# EAGLE design ArduinoInterface_v2.1 (EAGLE 9.2.1)
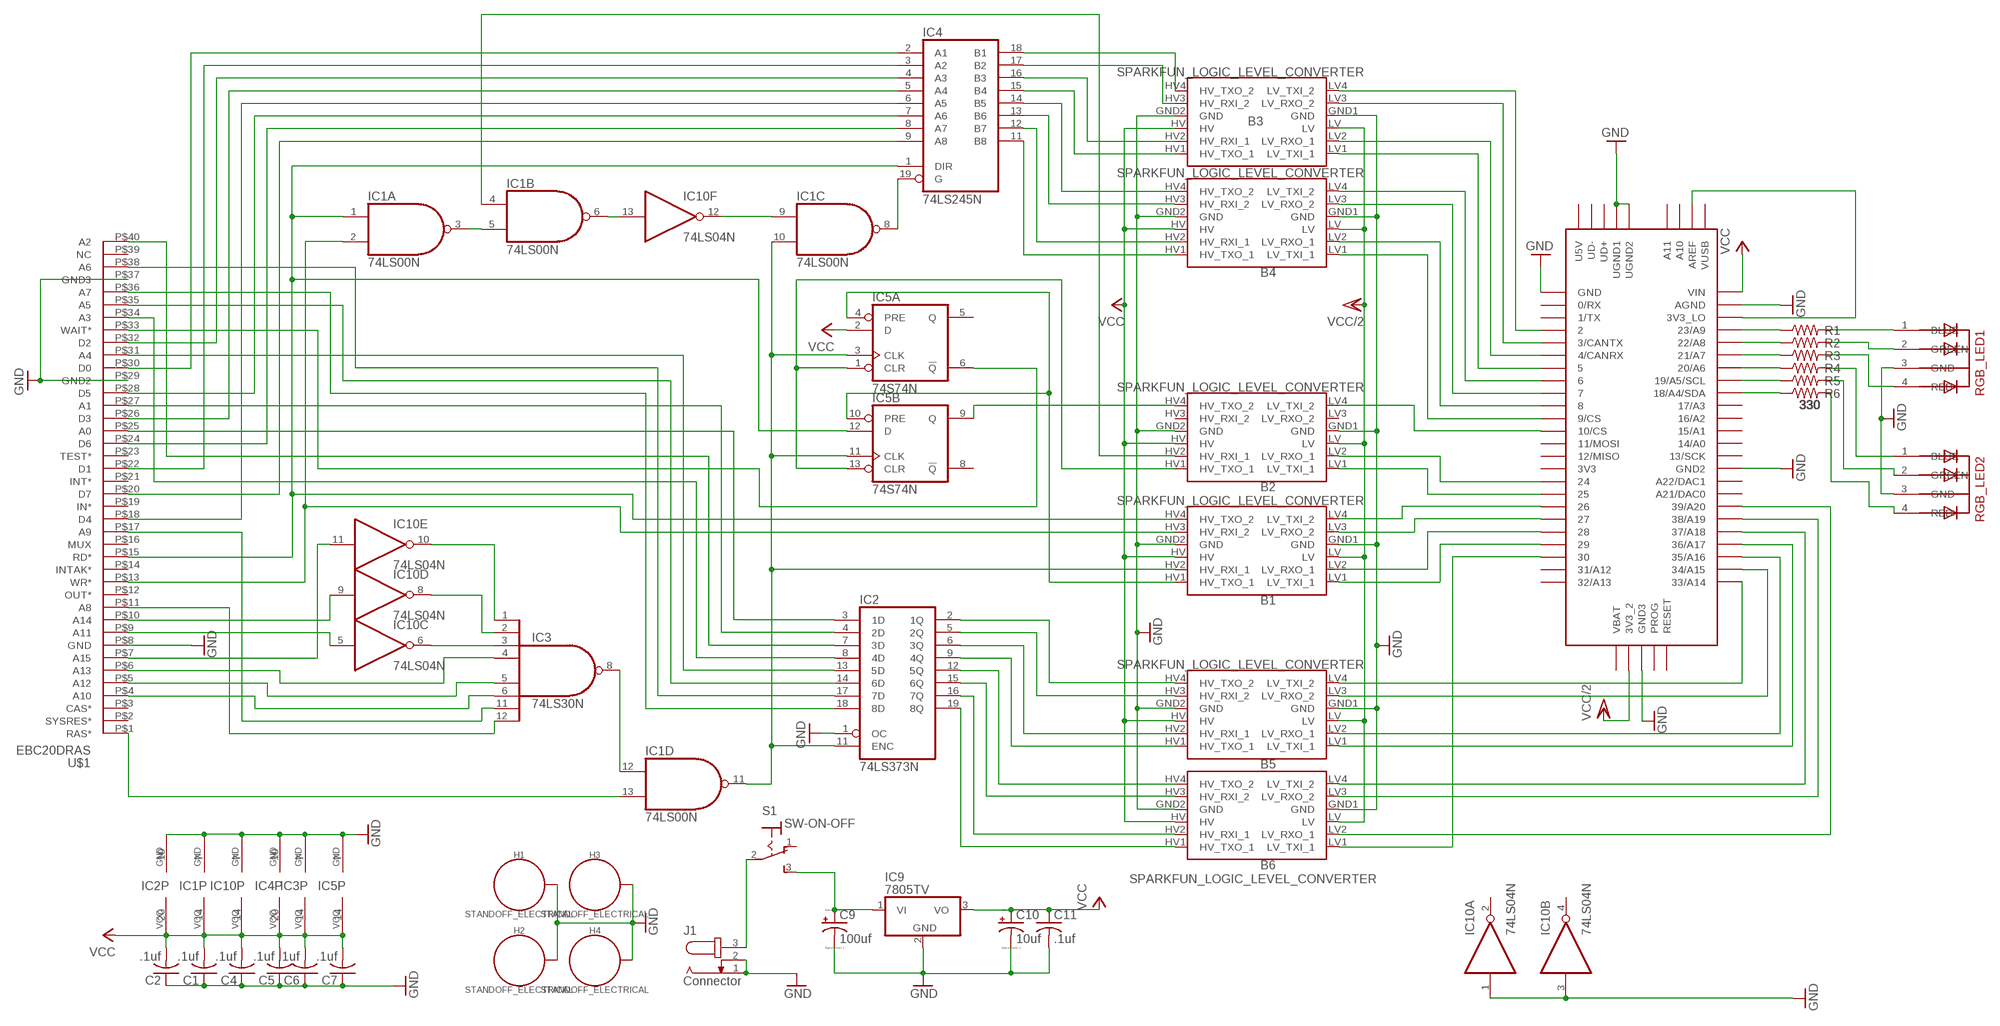
[diagram p0: schematic, sheet 1]

## Parts
B1  SPARKFUN_LOGIC_LEVEL_CONVERTER  [SPARKFUN_LOGIC_LEVEL_CONVERTER]
B2  SPARKFUN_LOGIC_LEVEL_CONVERTER  [SPARKFUN_LOGIC_LEVEL_CONVERTER]
B3  SPARKFUN_LOGIC_LEVEL_CONVERTER  [SPARKFUN_LOGIC_LEVEL_CONVERTER]
B4  SPARKFUN_LOGIC_LEVEL_CONVERTER  [SPARKFUN_LOGIC_LEVEL_CONVERTER]
B5  SPARKFUN_LOGIC_LEVEL_CONVERTER  [SPARKFUN_LOGIC_LEVEL_CONVERTER]
B6  SPARKFUN_LOGIC_LEVEL_CONVERTER  [SPARKFUN_LOGIC_LEVEL_CONVERTER]
C1  .1uf  C-US025-025X050  [C025-025X050]
C2  .1uf  C-US025-025X050  [C025-025X050]
C4  .1uf  C-US025-025X050  [C025-025X050]
C5  .1uf  C-US025-025X050  [C025-025X050]
C6  .1uf  C-US025-025X050  [C025-025X050]
C7  .1uf  C-US025-025X050  [C025-025X050]
C9  100uf  CPOL-USE5-6  [E5-6]
C10  10uf  CPOL-USE5-6  [E5-6]
C11  .1uf  C-US025-025X050  [C025-025X050]
H1  STANDOFF_ELECTRICAL  [STANDOFF-ELECTRICAL]
H2  STANDOFF_ELECTRICAL  [STANDOFF-ELECTRICAL]
H3  STANDOFF_ELECTRICAL  [STANDOFF-ELECTRICAL]
H4  STANDOFF_ELECTRICAL  [STANDOFF-ELECTRICAL]
IC1  74LS00N  [DIL14]
IC2  74LS373N  [DIL20]
IC3  74LS30N  [DIL14]
IC4  74LS245N  [DIL20]
IC5  74S74N  [DIL14]
IC9  7805TV  [TO220V]
IC10  74LS04N  [DIL14]
J1  Connector  JACK-PLUG0  [SPC4077]
R1  330  R-US_0204/2V  [0204V]
R2  330  R-US_0204/2V  [0204V]
R3  330  R-US_0204/2V  [0204V]
R4  330  R-US_0204/2V  [0204V]
R5  330  R-US_0204/2V  [0204V]
R6  330  R-US_0204/2V  [0204V]
RGB_LED1  5MMRGBLED  [LED5MMRGB]
RGB_LED2  5MMRGBLED  [LED5MMRGB]
S1  SW-ON-OFF  M9040P  [M9040P]
U$1  EBC20DRAS  [EBC20DRAS]
U$2  TEENSY_3.5/3.6  [TEENSY_3.5/3.6]

## Nets
A0: IC2.3(1D) U$1.P$25(A0)
A0_AFTER_LATCH: B5.HV4(HV_TXO_2) IC2.2(1Q)
A0_LV: B5.LV4(LV_TXI_2) U$2.33/A14
A1: IC2.4(2D) U$1.P$27(A1)
A1_AFTER_LATCH: B5.HV3(HV_RXI_2) IC2.5(2Q)
A1_LV: B5.LV3(LV_RXO_2) U$2.34/A15
A2: IC2.7(3D) U$1.P$40(A2)
A2_AFTER_LATCH: B5.HV2(HV_RXI_1) IC2.6(3Q)
A2_LV: B5.LV2(LV_RXO_1) U$2.35/A16
A3: IC2.8(4D) U$1.P$34(A3)
A3_AFTER_LATCH: B5.HV1(HV_TXO_1) IC2.9(4Q)
A3_LV: B5.LV1(LV_TXI_1) U$2.36/A17
A4: IC2.13(5D) U$1.P$31(A4)
A4_AFTER_LATCH: B6.HV4(HV_TXO_2) IC2.12(5Q)
A4_LV: B6.LV4(LV_TXI_2) U$2.37/A18
A5: IC2.14(6D) U$1.P$35(A5)
A5_AFTER_LATCH: B6.HV3(HV_RXI_2) IC2.15(6Q)
A5_LV: B6.LV3(LV_RXO_2) U$2.38/A19
A6: IC2.17(7D) U$1.P$38(A6)
A6_AFTER_LATCH: B6.HV2(HV_RXI_1) IC2.16(7Q)
A6_LV: B6.LV2(LV_RXO_1) U$2.39/A20
A7: IC2.18(8D) U$1.P$36(A7)
A7_AFTER_LATCH: B6.HV1(HV_TXO_1) IC2.19(8Q)
A7_LV: B6.LV1(LV_TXI_1) U$2.30
A8: IC3.12(I7) U$1.P$11(A8)
A9: IC3.11(I6) U$1.P$17(A9)
A10: IC3.6(I5) U$1.P$4(A10)
A11: IC10.5(C:I) U$1.P$9(A11)
A12: IC3.5(I4) U$1.P$5(A12)
A13: IC3.4(I3) U$1.P$6(A13)
A15: IC10.11(E:I) U$1.P$7(A15)
D0: IC4.2(A1) U$1.P$30(D0)
D0_LV: B3.LV4(LV_TXI_2) U$2.2
D1: IC4.3(A2) U$1.P$22(D1)
D1_LV: B3.LV3(LV_RXO_2) U$2.3/CANTX
D2: IC4.4(A3) U$1.P$32(D2)
D2_HV: B3.HV2(HV_RXI_1) IC4.16(B3)
D2_LV: B3.LV2(LV_RXO_1) U$2.4/CANRX
D3: IC4.5(A4) U$1.P$26(D3)
D3_HV: B3.HV1(HV_TXO_1) IC4.15(B4)
D3_LV: B3.LV1(LV_TXI_1) U$2.5
D4: IC4.6(A5) U$1.P$18(D4)
D4_HV: B4.HV4(HV_TXO_2) IC4.14(B5)
D4_LV: B4.LV4(LV_TXI_2) U$2.6
D5: IC4.7(A6) U$1.P$28(D5)
D5_HV: B4.HV3(HV_RXI_2) IC4.13(B6)
D5_LV: B4.LV3(LV_RXO_2) U$2.7
D6: IC4.8(A7) U$1.P$24(D6)
D6_HV: B4.HV2(HV_RXI_1) IC4.12(B7)
D6_LV: B4.LV2(LV_RXO_1) U$2.8
D7: IC4.9(A8) U$1.P$20(D7)
D7_HV: B4.HV1(HV_TXO_1) IC4.11(B8)
D7_LV: B4.LV1(LV_TXI_1) U$2.9/CS
DATA_BUS_ENABLE_: IC1.8(C:O) IC4.19(G)
DATA_BUS_ENABLE_HV_FROM_TEENSY: B2.HV2(HV_RXI_1) IC1.4(B:I0)
DATA_BUS_ENABLE_LV: B2.LV2(LV_RXO_1) U$2.24
FLIPFLOP_CLR: B2.HV1(HV_TXO_1) IC5.1(A:CLR) IC5.13(B:CLR)
FLIPFLOP_CLR_LV: B2.LV1(LV_TXI_1) U$2.25
FLIPFLOP_PRE: B1.HV1(HV_TXO_1) IC5.4(A:PRE) IC5.10(B:PRE)
FLIPFLOP_PRE_LV: B1.LV1(LV_TXI_1) U$2.29
GND: B1.GND1(GND) B1.GND2(GND) B2.GND1(GND) B2.GND2(GND) B3.GND1(GND) B3.GND2(GND) B4.GND1(GND) B4.GND2(GND) B5.GND1(GND) B5.GND2(GND) B6.GND1(GND) B6.GND2(GND) C1.1 C2.1 C4.1 C5.1 C6.1 C7.1 C9.- C10.- C11.2 H1.P1 H2.P1 H3.P1 H4.P1 IC1.7(P:GND) IC2.1(OC) IC2.10(GND) IC3.7(GND) IC4.10(GND) IC5.7(P:GND) IC9.2(GND) IC10.1(A:I) IC10.3(B:I) IC10.7(P:GND) J1.1 J1.2 RGB_LED1.3(GND) RGB_LED2.3(GND) U$1.P$8(GND) U$1.P$29(GND2) U$1.P$37(GND3) U$2.AGND U$2.GND U$2.GND2 U$2.GND3 U$2.UGND1 U$2.UGND2
INTERRUPT: B1.HV2(HV_RXI_1) IC1.10(C:I1) IC1.11(D:O) IC2.11(ENC) IC5.3(A:CLK) IC5.11(B:CLK)
INTERRUPT_LV: B1.LV2(LV_RXO_1) U$2.28
N$1: U$2.3V3_LO U$2.AREF
N$2: IC10.9(D:I) U$1.P$10(A14)
N$3: IC3.1(I0) IC10.10(E:O)
N$4: IC3.2(I1) IC10.8(D:O)
N$5: R1.1 U$2.23/A9
N$6: R2.1 U$2.22/A8
N$7: IC1.12(D:I0) IC3.8(O)
N$8: IC3.3(I2) IC10.6(C:O)
N$9: R3.1 U$2.21/A7
N$10: R1.2 RGB_LED1.1(BLUE)
N$12: C9.+ IC9.1(VI) S1.3(S)
N$13: B3.HV4(HV_TXO_2) IC4.18(B1)
N$14: R2.2 RGB_LED1.2(GREEN)
N$15: R3.2 RGB_LED1.4(RED)
N$16: R4.1 U$2.20/A6
N$17: R5.1 U$2.19/A5/SCL
N$18: R6.1 U$2.18/A4/SDA
N$19: R4.2 RGB_LED2.1(BLUE)
N$20: R5.2 RGB_LED2.2(GREEN)
N$21: R6.2 RGB_LED2.4(RED)
N$22: J1.3 S1.2(P)
N$24: B3.HV3(HV_RXI_2) IC4.17(B2)
N$26: IC1.13(D:I1) U$1.P$1(RAS*)
RD_: B1.HV4(HV_TXO_2) IC1.1(A:I0) IC4.1(DIR) IC5.12(B:D) U$1.P$15(RD*)
RD_LV_: B1.LV4(LV_TXI_2) U$2.26
RDX_OR_WRX_AND_DATA_BUS_ENABLE_FROM_TEENSY: IC1.9(C:I0) IC10.12(F:O)
RDX_OR_WRX_AND_DATA_BUS_ENABLE_FROM_TEENSY_: IC1.6(B:O) IC10.13(F:I)
READ_OR_WRITE: IC1.3(A:O) IC1.5(B:I1)
VCC: B1.HV B2.HV B3.HV B4.HV B5.HV B6.HV C1.2 C2.2 C4.2 C5.2 C6.2 C7.2 C10.+ C11.1 IC1.14(P:VCC) IC2.20(VCC) IC3.14(VCC) IC4.20(VCC) IC5.2(A:D) IC5.14(P:VCC) IC9.3(VO) IC10.14(P:VCC) U$2.VIN
VCC/2: B1.LV B2.LV B3.LV B4.LV B5.LV B6.LV U$2.3V3_2
WAIT_: IC5.6(A:!Q) U$1.P$33(WAIT*)
WR_: B1.HV3(HV_RXI_2) IC1.2(A:I1) U$1.P$13(WR*)
WR_HV: B2.HV4(HV_TXO_2) IC5.9(B:Q)
WR_LV: B2.LV4(LV_TXI_2) U$2.10/CS
WR_LV_: B1.LV3(LV_RXO_2) U$2.27
Unconnected: B2.HV3(HV_RXI_2) B2.LV3(LV_RXO_2) IC5.5(A:Q) IC5.8(B:!Q) IC10.2(A:O) IC10.4(B:O) S1.1(O) U$1.P$2(SYSRES*) U$1.P$3(CAS*) U$1.P$12(OUT*) U$1.P$14(INTAK*) U$1.P$16(MUX) U$1.P$19(IN*) U$1.P$21(INT*) U$1.P$23(TEST*) U$1.P$39(NC) U$2.0/RX U$2.1/TX U$2.3V3 U$2.11/MOSI U$2.12/MISO U$2.13/SCK U$2.14/A0 U$2.15/A1 U$2.16/A2 U$2.17/A3 U$2.21/DAC0(A21/DAC0) U$2.31/A12 U$2.32/A13 U$2.A10 U$2.A11 U$2.A22/DAC1 U$2.PROG U$2.RESET U$2.U5V U$2.UD+ U$2.UD- U$2.VBAT U$2.VUSB

## Library data of the parts
B1-B6 = SparkFun-Boards:SPARKFUN_LOGIC_LEVEL_CONVERTER: SparkFun Logic Level Converter -Bi-Directional This is the mechnical outline for the 3.3V - 5V bi directional logic level converter. *Note, the "LOCK" Package has the header pins staggered by an offset of 5 mils (off center line), so that when you slide a row of standard 0.1" headers into the PTH pads, it will hold position vertically. See the follwing turorial for more information on this type of special footprints: Sneaky Footprints <https://www.sparkfun.com/tutorials/114> SparkFun Products: SparkFun Logic Level Converter - Bi-Directional <https://www.sparkfun.com/products/12009>
C1 C2 C4-C7 C11 = adafruit:C-US: CAPACITOR, American symbol
C9 C10 = resistor:CPOL-US: POLARIZED CAPACITOR, American symbol
H1-H4 = SparkFun-Hardware:STANDOFF_ELECTRICAL: Stand Off Drill holes with an electrical connection. For example, use these to ground your board to a chassis. Example SparkFun Products Screw - Phillips Head (1/4", 4-40, 10 pack) <https://www.sparkfun.com/products/10453> (PRT-10453) Screw - Phillips Head (1/2", 4-40, 10 pack) <https://www.sparkfun.com/products/10452> (PRT-10452) Screw - Phillips Head (3/4", 4-40, 10 pack) <https://www.sparkfun.com/products/10451> (PRT-10451) Screw - Phillips Head (1", 4-40, 10 pack) <https://www.sparkfun.com/products/10450> (PRT-10450)
IC1 = 74xx-us:74*00: Quad 2-input NAND gate
IC2 = 74xx-us:74*373: Octal D type transparent LATCH, edge triggered
IC3 = 74xx-us:74*30: 8-input NAND gate
IC4 = 74xx-us:74*245: Octal BUS TRANSCEIVER, 3-state
IC5 = 74xx-us:74*74: Dual D type positive edge triggered FLIP FLOP, preset and clear
IC9 = linear:78*: Positive VOLTAGE REGULATOR Source: http://cache.national.com/ds/LM/LM78L05.pdf http://www.fairchildsemi.com/ds/LM/LM7805.pdf
IC10 = 74xx-us:74*04: Hex INVERTER
J1 = con-jack:JACK-PLUG: DC POWER JACK Power Jack, DC, Right Angle, Through Hole, Rated 5A at 16VDC, PC Terminals Distributor: Farnell (www.Farnell.de) Drawing: 84N1161.pdf / 84N1162.pdf Manufacturer: SPC Technology (www.spctechnology.com) Type: SPC4077 / SPC 4078; OC_FARNELL: unknown; OC_NEWARK: unknown
R1-R6 = resistor:R-US_: RESISTOR, American symbol
RGB_LED1 RGB_LED2 = adafruit:5MMRGBLED
S1 = switch:M9040P: TOGGLE SWITCH Marquardt
U$1 = TMS99:EBC20DRAS
U$2 = Teensy356:TEENSY_3.5/3.6

## Net classes
0 default: width 0.3 mm, clearance 0.05 mm

## Board
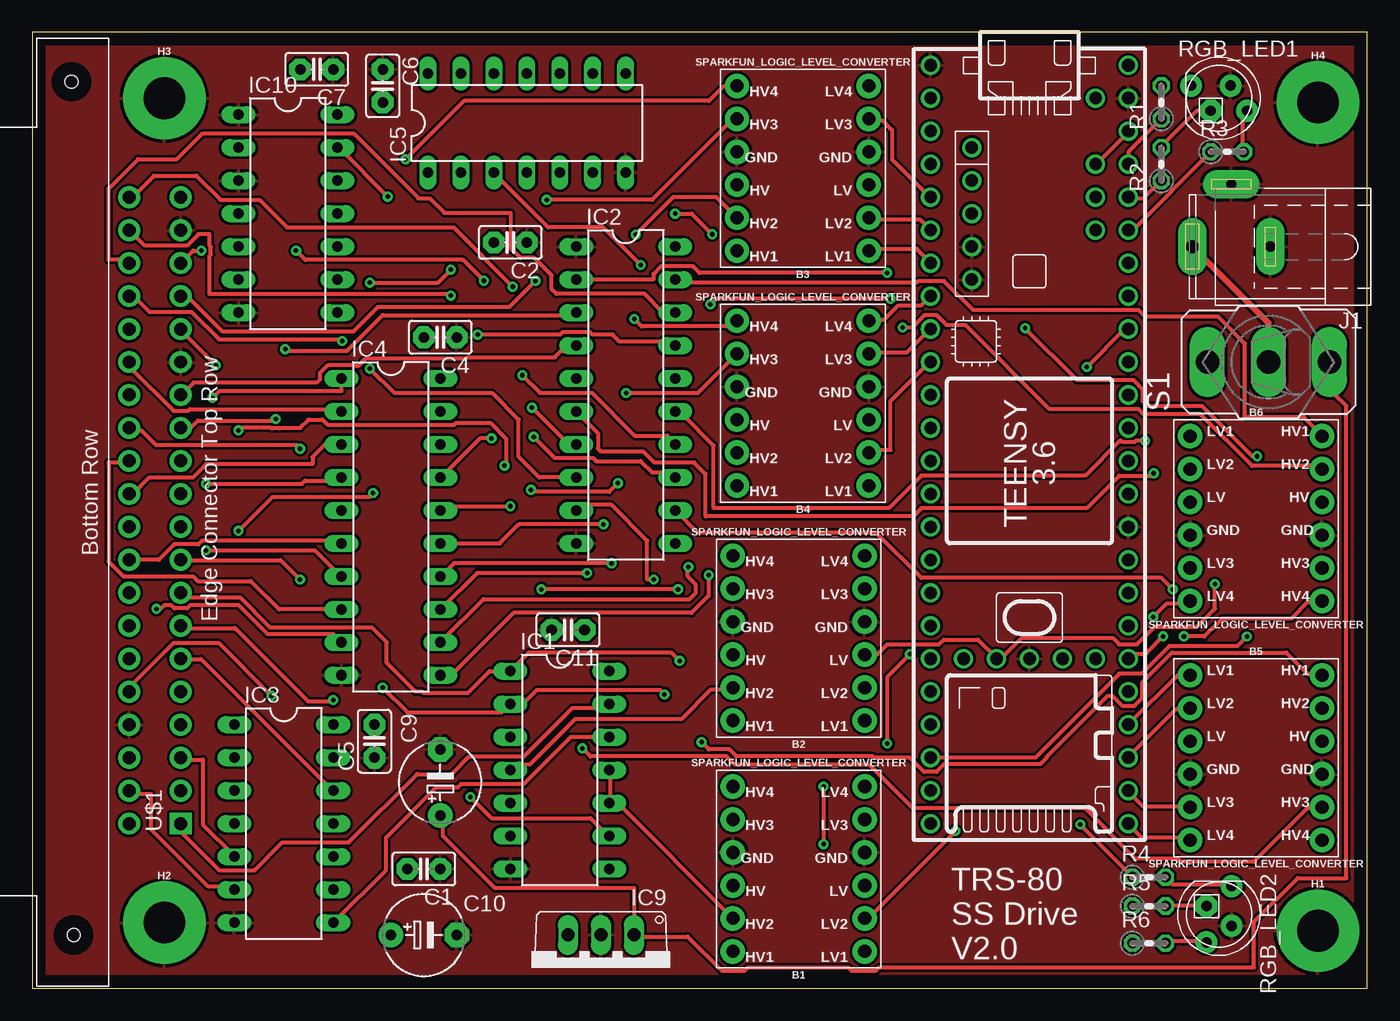
[diagram p1: board, top side]
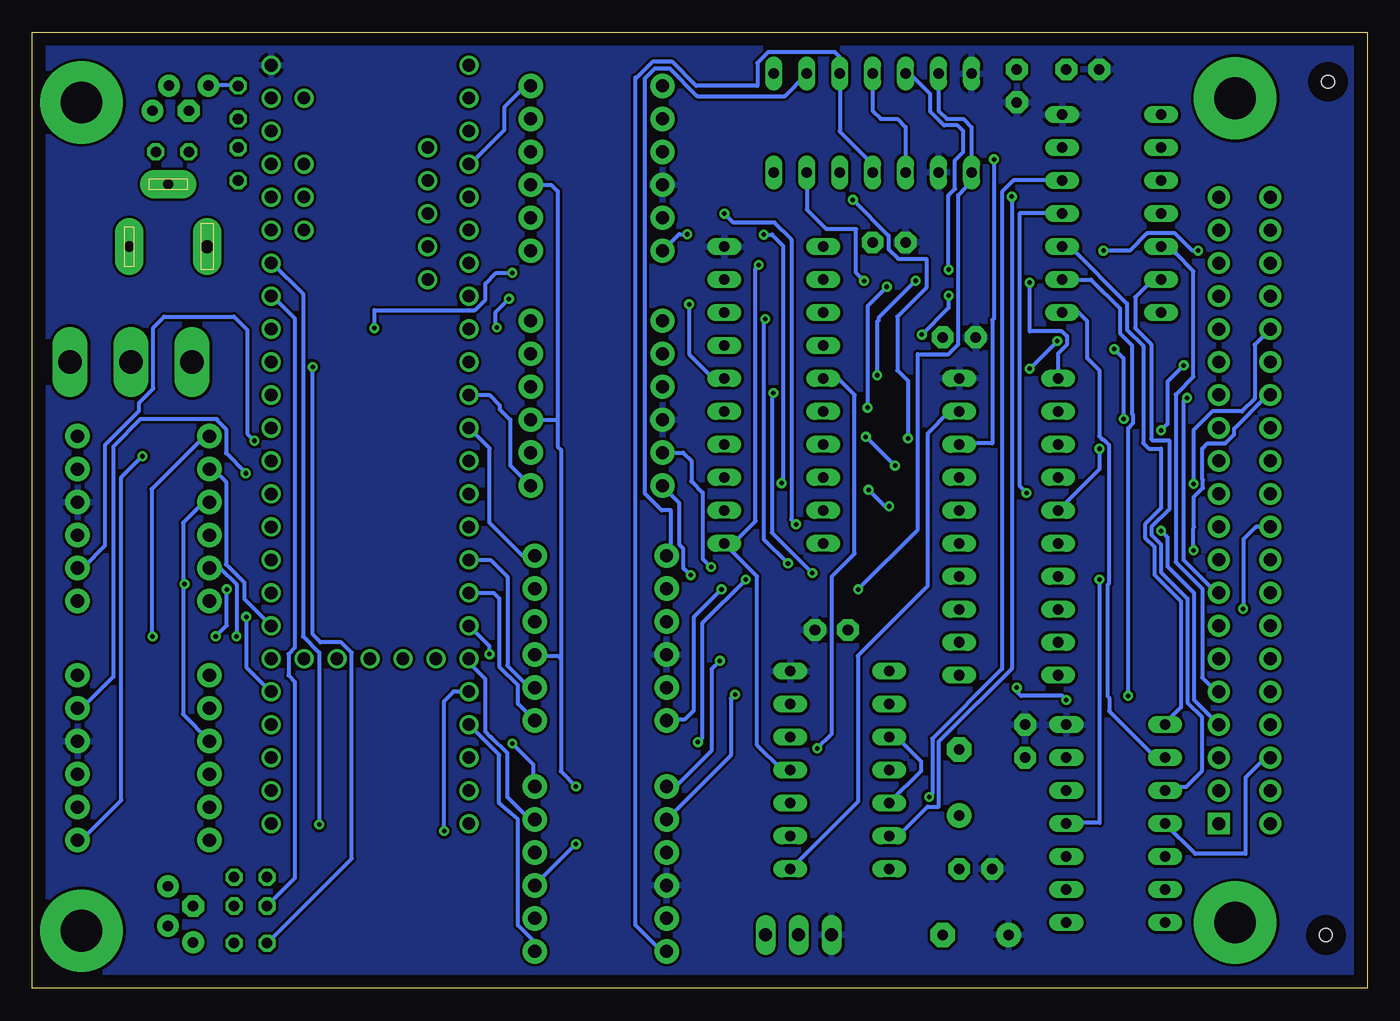
[diagram p2: board, bottom side, seen from below]

Size 102.85 x 73.65 mm. Coordinates in mm from the lower left corner, seen from the top.
Outline: 0,0 102.85,0 102.85,73.65 0,73.65 0,0
Copper layers (1*16): Top 0.035mm / dielectric 1.5mm / Bottom 0.035mm
Design rules "default": minimum track width 0.2mm, minimum drill 0.35mm, track to track 8mil, track to pad 8mil, pad to pad 8mil, via to via 8mil, smd to smd 8mil, copper to edge 40mil, drill to drill 6mil, minimum pad ring 10mil, minimum via ring 8mil, stop-mask expansion 4mil, vias tented up to drill 0mil, thermal gap 10mil

### Footprints (pad centres in the part's own frame; a part is rotated, then mirrored left to right if it is on the bottom)
SPARKFUN_LOGIC_LEVEL_CONVERTER = drill 1.016 pad 1.88: GND1 -5.08,-1.27; GND2 5.08,-1.27; HV 5.08,1.27; HV1 5.08,6.35; HV2 5.08,3.81; HV3 5.08,-3.81; HV4 5.08,-6.35; LV -5.08,1.27; LV1 -5.08,6.35; LV2 -5.08,3.81; LV3 -5.08,-3.81; LV4 -5.08,-6.35
C025-025X050 = drill 0.813 pad 1.676 octagon: 1 -1.27,0; 2 1.27,0
E5-6 = drill 0.813 pad 1.905: + -2.54,0 | drill 0.813 pad 1.905 octagon: - 2.54,0
STANDOFF-ELECTRICAL = drill 3.2 pad 6.35: P1 0,0
DIL14 = drill 0.813 long: 1 -7.62,-3.81; 2 -5.08,-3.81; 3 -2.54,-3.81; 4 0,-3.81; 5 2.54,-3.81; 6 5.08,-3.81; 7 7.62,-3.81; 8 7.62,3.81; 9 5.08,3.81; 10 2.54,3.81; 11 0,3.81; 12 -2.54,3.81; 13 -5.08,3.81; 14 -7.62,3.81
DIL20 = drill 0.813 long: 1 -11.43,-3.81; 2 -8.89,-3.81; 3 -6.35,-3.81; 4 -3.81,-3.81; 5 -1.27,-3.81; 6 1.27,-3.81; 7 3.81,-3.81; 8 6.35,-3.81; 9 8.89,-3.81; 10 11.43,-3.81; 11 11.43,3.81; 12 8.89,3.81; 13 6.35,3.81; 14 3.81,3.81; 15 1.27,3.81; 16 -1.27,3.81; 17 -3.81,3.81; 18 -6.35,3.81; 19 -8.89,3.81; 20 -11.43,3.81
TO220V = drill 1.016 long: 1 -2.54,-2.54; 2 0,-2.54; 3 2.54,-2.54
SPC4077 = drill 0.8 pad 2.184 long: 1 -3,0; 2 0,-4.8 | drill 1 pad 2.184 long: 3 3,0
0204V = drill 0.813 octagon: 1 -1.27,0; 2 1.27,0
LED5MMRGB = drill 0.8 pad 1.676: 1 -2.159,0.968; 3 0.889,0.968; 4 2.159,-0.968 | drill 0.8 pad 1.676 octagon: 2 -0.635,-0.968
M9040P = drill 1.803 long: 1 0,4.699; 2 0,0; 3 0,-4.699
EBC20DRAS = drill 1 pad 1.676 square: P$1 0,0 | drill 1 pad 1.676: P$2 0,3.969; P$3 2.54,0; P$4 2.54,3.969; P$5 5.08,0; P$6 5.08,3.969; P$7 7.62,0; P$8 7.62,3.969; P$9 10.16,0; P$10 10.16,3.969; P$11 12.7,0; P$12 12.7,3.969; P$13 15.24,0; P$14 15.24,3.969; P$15 17.78,0; P$16 17.78,3.969; P$17 20.32,0; P$18 20.32,3.969; P$19 22.86,0; P$20 22.86,3.969; P$21 25.4,0; P$22 25.4,3.969; P$23 27.94,0; P$24 27.94,3.969; P$25 30.48,0; P$26 30.48,3.969; P$27 33.02,0; P$28 33.02,3.969; P$29 35.56,0; P$30 35.56,3.969; P$31 38.1,0; P$32 38.1,3.969; P$33 40.64,0; P$34 40.64,3.969; P$35 43.18,0; P$36 43.18,3.969; P$37 45.72,0; P$38 45.72,3.969; P$39 48.26,0; P$40 48.26,3.969 | hole 1: -8.572,8.255; 57.15,8.414
TEENSY_3.5/3.6 = drill 0.965: 0/RX -25.4,-7.62; 1/TX -22.86,-7.62; 2 -20.32,-7.62; 3/CANTX -17.78,-7.62; 3V3 7.62,-7.62; 3V3_2 17.78,-2.54; 3V3_LO -22.86,7.62; 4/CANRX -15.24,-7.62; 5 -12.7,-7.62; 6 -10.16,-7.62; 7 -7.62,-7.62; 8 -5.08,-7.62; 9/CS -2.54,-7.62; 10/CS 0,-7.62; 11/MOSI 2.54,-7.62; 12/MISO 5.08,-7.62; 13/SCK 5.08,7.62; 14/A0 2.54,7.62; 15/A1 0,7.62; 16/A2 -2.54,7.62; 17/A3 -5.08,7.62; 18/A4/SDA -7.62,7.62; 19/A5/SCL -10.16,7.62; 20/A6 -12.7,7.62; 21/A7 -15.24,7.62; 21/DAC0 12.7,7.62; 22/A8 -17.78,7.62; 23/A9 -20.32,7.62; 24 10.16,-7.62; 25 12.7,-7.62; 26 15.24,-7.62; 27 17.78,-7.62; 28 20.32,-7.62; 29 22.86,-7.62; 30 25.4,-7.62; 31/A12 27.94,-7.62; 32/A13 30.48,-7.62; 33/A14 30.48,7.62; 34/A15 27.94,7.62; 35/A16 25.4,7.62; 36/A17 22.86,7.62; 37/A18 20.32,7.62; 38/A19 17.78,7.62; 39/A20 15.24,7.62; A10 -17.78,5.08; A11 -15.24,5.08; A22/DAC1 10.16,7.62; AGND -25.4,7.62; AREF -20.32,5.08; GND -27.94,-7.62; GND2 7.62,7.62; GND3 17.78,0; PROG 17.78,2.54; RESET 17.78,5.08; U5V -21.59,-4.445; UD+ -16.51,-4.445; UD- -19.05,-4.445; UGND1 -13.97,-4.445; UGND2 -11.43,-4.445; VBAT 17.78,-5.08; VIN -27.94,7.62; VUSB -25.4,5.08

### Placement (x,y rotation side)
B1  59.05,9.21 180 top
B2  59.05,26.99 180 top
B3  59.37,63.18 180 top
B4  59.37,45.09 180 top
B5  94.3,17.78 0 top
B6  94.3,36.2 0 top
C1  30.16,9.21 180 top
C2  36.83,57.47 180 top
C4  31.43,50.16 180 top
C5  26.35,19.05 90 top
C6  26.99,69.53 270 top
C7  21.91,70.8 180 top
C9  31.43,15.88 90 top
C10  30.16,4.13 0 top
C11  41.27,27.62 180 top
H1  99.06,4.45 0 top
H2  10.16,5.08 0 top
H3  10.16,68.58 0 top
H4  99.06,68.26 0 top
IC1  40.64,16.83 270 top
IC2  45.72,45.72 270 top
IC3  19.37,12.7 270 top
IC4  27.62,35.56 270 top
IC5  38.1,66.67 0 top
IC9  43.81,1.59 180 top
IC10  19.68,59.69 270 top
J1  92.39,57.15 180 top
R1  87,68.26 90 top
R2  87,63.5 90 top
R3  92.08,64.45 0 top
R4  86.04,8.57 0 top
R5  86.04,6.35 0 top
R6  86.04,3.49 0 top
RGB_LED1  91.44,68.58 0 top
RGB_LED2  91.44,5.71 270 top
S1  95.25,48.26 90 top
U$1  11.43,12.7 90 top
U$2  76.83,43.18 270 top

### Tracks (layer width: path | path; a pad name or v marks a point on that pad's centre or on a via)
A0  (via drill 0.35)
  Top 0.3: v19.48,49.25 19.48,49.12 24.25,49.12 27,51.88 41.75,51.88 41.88,52 IC2.3 | v18.75,43.88 18.62,43.75 12.75,43.75 12.25,43.25 11.5,43.25 U$1.P$25
  Bottom 0.3: v19.48,49.25 18.75,48.52 v18.75,43.88
A0_AFTER_LATCH  (via drill 0.35)
  Top 0.3: v65.88,55.12 51.4,55.12 50.9,55.62 48.45,55.62 47.86,55.03 47.86,54.61 IC2.2 | v76.5,50.87 80.49,46.88 84.84,46.88 85.55,46.17 85.55,45.27 85.94,44.88 90.12,44.88 94,41 v94.38,41
  Bottom 0.3: v76.5,50.87 76.5,52.25 68.75,52.25 67.94,53.05 67.94,54.29 67.11,55.12 v65.88,55.12 | v94.38,41 96,39.38 96,14.5 99,11.5 99.38,11.5 B5.HV4
A0_LV
  Top 0.3: U$2.33/A14 84.5,12.62 85.5,11.62 89,11.62 89.12,11.5 B5.LV4
A1
  Top 0.3: IC2.4 41.88,49.5 41.5,49.12 40.75,49.12 40.25,48.62 33.5,48.62 33.38,48.5 25.64,48.5 25.08,47.94 24.95,47.94 24.89,48 22.73,48 22.14,47.41 22.14,46.9 21.91,46.67 12.42,46.67 11.5,45.75 U$1.P$27
A1_AFTER_LATCH  (via drill 0.35)
  Top 0.3: v42.38,18.5 43,17.88 53.5,17.88 54.12,17.25 64.49,17.25 67.86,13.88 81.12,13.88 85,10 88.25,10 88.5,9.75 94.12,9.75 98.25,13.88 99.38,13.88 B5.HV3
  Bottom 0.3: v42.38,18.5 41.25,19.62 41.25,31.75 39.5,33.5 39.5,45.72 40.77,46.99 IC2.5
A1_LV
  Top 0.3: U$2.34/A15 84.5,15.12 85.62,14 89.12,14 B5.LV3
A2  (via drill 0.35)
  Top 0.3: IC2.7 41.33,41.91 v38.5,44.74 | v37.01,54.06 32.44,58.62 19.62,58.62 17.5,60.75 14.5,60.75 12.62,62.62 9.38,62.62 7.75,61 7.5,61 U$1.P$40
  Bottom 0.3: v38.5,44.74 38.5,52.57 v37.01,54.06
A2_AFTER_LATCH  (via drill 0.35)
  Top 0.3: 42,44.38 IC2.6 43.58,42.78 43.58,41.59 43.8,41.38 47.05,41.38 47.93,40.5 51,40.5 51.88,39.62 51.88,36.38 67.88,36.38 68.5,37 81.25,37 83.75,39.5 86.22,39.5 v86.41,39.69
  Bottom 0.3: B5.HV2 99.38,21.62 99,21.62 96.62,24 96.62,41.75 94.5,43.88 88.62,43.88 88.62,43.78 87.92,43.08 87.92,41.25 86.41,39.74 v86.41,39.69
A2_LV
  Top 0.3: U$2.35/A16 84.5,17.88 88.12,21.5 89.12,21.5 B5.LV2
A3  (via drill 0.35)
  Top 0.3: v26,47.75 27.88,45.88 35.41,45.88 37.47,43.81 37.47,40.96 39.05,39.37 IC2.8 | v23.88,49.88 23.75,50 14.38,50 12.25,52.12 9,52.12 7.88,53.25 7.5,53.25 U$1.P$34
  Bottom 0.3: v23.88,49.88 v26,47.75
A3_AFTER_LATCH  (via drill 0.35)
  Top 0.3: v47.88,31.5 47.38,31.5 47.38,34.5 44.62,37.25 42.38,37.25 42,36.88 IC2.9 | B5.HV1 99.38,24.25 98.25,24.25 96.63,25.87 87.81,25.87 85.55,23.6 85.55,22.41 84.91,21.77 84,21.77 83.23,22.54 82.87,22.54 78.16,17.84 78.16,17.76 77.68,17.28 70.25,17.28 69.67,16.69 68.72,16.69 67.63,17.78 64.87,17.78 64.78,17.88 54.25,17.88 53.71,18.41 52.12,18.41 v51.57,18.97
  Bottom 0.3: v47.88,31.5 51.25,28.12 51.25,19.29 v51.57,18.97
A3_LV
  Top 0.3: U$2.36/A17 84.5,20.38 88.25,24.12 89.12,24.12 B5.LV1
A4  (via drill 0.35)
  Top 0.3: v38.62,42.5 40.25,40.88 43.19,40.88 43.44,40.62 46.88,40.62 47.75,39.75 49.12,39.75 49.5,39.38 IC2.13 | v14.12,48 11.38,50.75 U$1.P$31 | v36.38,40.28 36.51,40.41 36.51,42.34 35.29,43.56 32.64,43.56 32.51,43.44 22.73,43.44 22.35,43.81 21.27,43.81 20.64,43.18 19.09,43.18 19.05,43.14 18.45,43.14 18.41,43.18 16.05,43.18 v15.88,43
  Bottom 0.3: v38.62,42.5 36.4,40.28 v36.38,40.28 | v15.88,43 15.38,43.5 15.38,46.75 v14.12,48
A4_AFTER_LATCH  (via drill 0.35)
  Top 0.3: v87.88,30.75 87,31.62 68.5,31.62 65,35.12 51.25,35.12 49.62,36.75 IC2.12 | v88.73,27.12 90.32,27.12 91.69,28.5 97,28.5 98.25,29.75 99.38,29.75 B6.HV4
  Bottom 0.3: v87.88,30.75 87.88,27.98 v88.73,27.12
A4_LV  (via drill 0.35)
  Top 0.3: v86.38,28.62 87.38,29.62 89,29.62 89.12,29.75 B6.LV4
  Bottom 0.3: v86.38,28.62 86.38,24.75 84.5,22.88 U$2.37/A18
A5  (via drill 0.35)
  Top 0.3: v37.75,47.24 39.12,45.88 43.12,45.88 46.41,42.59 48.91,42.59 49.5,42 IC2.14 | v34.79,54.52 33.17,56.14 21.02,56.14 v20.32,56.83 | U$1.P$35 12.38,56.83 v13.02,56.83
  Bottom 0.3: v37.75,47.24 37.75,51.37 37.65,51.47 37.65,51.66 v34.79,54.52 | v13.02,56.83 13.46,56.83 14.79,58.16 16.95,58.16 18.29,56.83 v20.32,56.83
A5_AFTER_LATCH  (via drill 0.35)
  Top 0.3: v85.75,42.19 85.01,42.19 84.91,42.09 84,42.09 83.9,42.19 83.82,42.19 81.12,39.5 68.5,39.5 66,37 52.5,37 52.5,41.82 50.16,44.15 50.16,44.45 IC2.15
  Bottom 0.3: B6.HV3 99.38,32.5 98.88,32.5 97.25,34.12 97.25,41.88 94.62,44.5 94.62,45.12 93.54,46.2 93.54,50.92 92.71,51.75 87.31,51.75 86.3,50.74 86.3,42.74 v85.75,42.19
A5_LV  (via drill 0.35)
  Top 0.3: v87.12,27.12 85.75,25.75 84.75,25.75 84.5,25.5 U$2.38/A19
  Bottom 0.3: v87.12,27.12 87.12,31.12 88.38,32.38 89.12,32.38 B6.LV3
A6  (via drill 0.35)
  Top 0.3: v32.25,53.38 32.12,53.5 13.65,53.5 13.65,56.43 13.75,56.53 13.75,57.13 13.65,57.23 13.65,58.1 12.8,58.1 11.92,57.23 8.65,57.23 U$1.P$38 | IC2.17 49.5,49.62 49.25,49.88 45.2,49.88 44.71,50.37 43.17,50.37 42.99,50.54 40.83,50.54 40.65,50.37 v34.31,50.37
  Bottom 0.3: v34.31,50.37 32.25,52.42 v32.25,53.38
A6_AFTER_LATCH  (via drill 0.35)
  Top 0.3: v52.25,52.7 52.67,53.12 v66.12,53.12 | B6.HV2 99.38,40.12 99.25,40.25 94,40.25 90,44.25 85.62,44.25 85.25,44.62 78.38,44.62 71.88,51.12 70.44,51.12 69.67,51.89 68.76,51.89 67.8,50.92 v67.06,50.92
  Bottom 0.3: v52.25,52.7 52.25,48.88 50.62,47.25 50.62,47 49.62,47 IC2.16 | v66.12,53.12 67.18,52.07 67.18,51.05 v67.06,50.92
A6_LV
  Bottom 0.3: U$2.39/A20 84.5,28 86.5,30 86.5,31.25 87.92,32.68 87.92,39.02 88.91,40.01 B6.LV2
A7
  Top 0.3: IC2.18 48.6,52.07 47.17,53.5 40.38,53.5 40.01,53.87 40.01,54.93 38.66,56.28 37.61,56.28 36.88,57 36.88,59.75 31.75,59.75 30.62,60.88 29.75,60.88 24.75,65.88 13.12,65.88 11.13,63.88 8.13,63.88 5.88,61.62 5.88,56.12 7.25,56.12 7.38,56 U$1.P$36
A7_AFTER_LATCH
  Top 0.3: IC2.19 49.62,54.5 49.75,54.38 68.12,54.38 68.25,54.5 70.25,54.5 72.5,52.25 85.25,52.25 85.75,51.75 91.38,51.75 93.44,49.68 93.44,44.02 97.98,44.02 99.38,42.62 B6.HV1
A7_LV  (via drill 0.35)
  Top 0.3: v93.59,27.11 92.85,26.38 87.61,26.38 85.48,24.25 83.75,24.25 77.28,17.78 U$2.30
  Bottom 0.3: B6.LV1 89.25,42.5 89.62,42.5 93.66,38.46 93.66,27.19 v93.59,27.11
A8
  Top 0.3: IC3.12 23.12,15.25 13,25.38 11.5,25.38 U$1.P$11
A9  (via drill 0.35)
  Top 0.3: v20.62,31.5 19.12,33 11.5,33 U$1.P$17
  Bottom 0.3: v20.62,31.5 20.62,12.75 23.12,12.75 IC3.11
A10
  Top 0.3: IC3.6 15.5,7.62 15.25,7.88 13.5,7.88 9.12,12.25 9.12,15 8.25,15 8.12,15.12 7.5,15.12 U$1.P$4
A11
  Bottom 0.3: IC10.5 15.88,57.12 14.75,57.12 14.75,56.62 13.38,55.25 13.38,47.12 14.75,45.75 14.75,32.85 12.7,30.8 12.7,23.95 11.5,22.75 U$1.P$9
A12
  Top 0.3: IC3.5 15.5,10.25 13.12,12.62 13.12,17.62 11.62,17.62 11.5,17.75 U$1.P$5
A13
  Bottom 0.3: IC3.4 15.5,12.62 13.25,10.38 9.38,10.38 9.38,16.25 7.88,17.75 7.5,17.75 U$1.P$6
A15  (via drill 0.35)
  Top 0.3: v26.25,38.17 25.95,37.88 18.5,37.88 v15.88,35.25
  Bottom 0.3: v26.25,38.17 26.75,38.67 26.75,59.75 23.5,59.75 IC10.11 | v15.88,35.25 15.38,34.75 15.38,32.52 13.34,30.48 13.34,22.23 11.5,20.39 11.5,20.38 U$1.P$7
D0
  Top 0.3: IC4.2 23.75,44.5 23.62,44.62 12.12,44.62 12,44.5 10.88,44.5 7.5,47.88 7.5,48.25 U$1.P$30
D0_LV
  Bottom 0.3: U$2.2 69.12,63.5 66.5,66.12 66.5,67.88 64.88,69.5 64.5,69.5 B3.LV4
D1
  Top 0.3: U$1.P$22 7.5,38.12 7.75,38.12 9,39.38 12.38,39.38 13.38,40.38 21.59,40.38 21.59,40.96 22.54,41.91 IC4.3
D1_LV
  Top 0.3: U$2.3/CANTX 69.12,61 66.25,63.88 66.25,66.12 65.5,66.88 64.5,66.88 B3.LV3
D2  (via drill 0.35)
  Top 0.3: v13.38,38.88 20.75,38.88 21,39.12 23.62,39.12 23.75,39.25 IC4.4
  Bottom 0.3: v13.38,38.88 13.38,43 11.93,44.45 9.64,44.45 8.65,45.43 8.65,49.61 U$1.P$32
D2_HV  (via drill 0.35)
  Top 0.3: v45.12,38.92 44.45,38.25 38.59,38.25 v38.42,38.42 | 31.5,36.88 IC4.16 32.07,36.83 32.38,37.15 v36.83,37.15 | B3.HV2 52.7,60.96 49.38,60.96 v46.49,58.07
  Bottom 0.3: v45.12,38.92 45,39.05 45,57.21 45.85,58.07 v46.49,58.07 | v38.42,38.42 37.15,37.15 v36.83,37.15
D2_LV
  Top 0.3: U$2.4/CANRX 69.12,58.5 68.38,59.25 64.5,59.25 B3.LV2
D3  (via drill 0.35)
  Top 0.3: v20.62,41.58 20.33,41.88 9.5,41.88 8.38,43 7.62,43 7.5,43.12 U$1.P$26
  Bottom 0.3: v20.62,41.58 20.62,40 23.75,36.88 IC4.5
D3_HV  (via drill 0.35)
  Top 0.3: v44,35.75 37.47,35.75 36.01,34.29 IC4.15 | v49.53,59.69 50.8,59.69 v52.39,58.1
  Bottom 0.3: v44,35.75 44.38,36.12 44.38,57.71 45.66,59 48.84,59 v49.53,59.69 | 53.88,56.88 54.25,56.88 B3.HV1 53.02,58.1 v52.39,58.1
D3_LV
  Top 0.3: U$2.5 69.12,56 68.12,57 64.62,57 64.5,56.88 B3.LV1
D4
  Top 0.3: IC4.6 23.75,34.38 23.62,34.5 13.08,34.5 12.79,34.21 10.94,34.21 9.74,33.02 U$1.P$18
D4_HV  (via drill 0.35)
  Top 0.3: v44.62,32.75 32.5,32.75 31.5,31.75 IC4.14 | v46.38,51.58 46.95,51 53.88,51 54.25,51.38 B4.HV4
  Bottom 0.3: v44.62,32.75 46.5,34.62 46.5,51.58 v46.38,51.58
D4_LV
  Top 0.3: U$2.6 68.5,52.62 66.75,52.62 65.62,51.5 64.5,51.5 B4.LV4
D5  (via drill 0.35)
  Top 0.3: v13.38,33.75 21.75,33.75 23.75,31.75 IC4.7
  Bottom 0.3: v13.38,33.75 13.38,35.5 13.34,35.54 13.34,37.88 12.64,38.57 12.64,39.18 12.7,39.23 12.7,41.59 12.3,41.99 10.94,41.99 10.24,42.69 10.24,43.14 7.75,45.62 7.5,45.62 U$1.P$28
D5_HV  (via drill 0.35)
  Top 0.3: v42.75,32 34.25,32 31.5,29.25 IC4.13 | v45.75,45.88 51.27,45.88 B4.HV3
  Bottom 0.3: v42.75,32 45.88,35.12 45.88,45.75 v45.75,45.88
D5_LV
  Top 0.3: U$2.7 69.12,50.75 67.38,49 64.5,49 B4.LV3
D6
  Top 0.3: 23.75,29.25 IC4.8 19,29.21 16.83,31.39 12.74,31.39 12.38,31.75 7,31.75 5.88,32.88 5.88,40.5 7.25,40.5 7.38,40.62 U$1.P$24
D6_HV  (via drill 0.35)
  Top 0.3: IC4.12 31.5,26.75 34.75,30 50.64,30 51.12,30.48 51.12,31.11 50.48,31.75 50.48,32.4 v50.55,32.46
  Bottom 0.3: 54.25,41.25 B4.HV2 52.7,41.27 52.07,40.64 52.07,39.07 51.2,38.2 51.2,33.12 v50.55,32.46
D6_LV
  Top 0.3: U$2.8 69.12,48.25 66.12,45.25 66.12,41.5 64.62,41.5 64.5,41.38 B4.LV2
D7  (via drill 0.35)
  Top 0.3: IC4.9 23.18,27.3 18.11,27.3 15.88,29.53 12.17,29.53 11.92,29.29 10.94,29.29 10.69,29.53 10.16,29.53 9.88,29.25 v9.56,29.25
  Bottom 0.3: 9.69,29.39 v9.56,29.25 9.53,29.28 9.53,34.61 8.57,35.56 U$1.P$20
D7_HV  (via drill 0.35)
  Top 0.3: IC4.11 32.26,24.13 37.06,28.93 50.81,28.93 52.12,30.24 v52.12,31.84
  Bottom 0.3: B4.HV1 54.26,38.64 53,37.38 53,34.19 52.68,33.87 52.68,32.36 52.16,31.84 v52.12,31.84
D7_LV
  Bottom 0.3: U$2.9/CS 67.63,45.72 66.84,44.92 | 66.84,44.92 66.82,44.91 | B4.LV1 64.5,38.75 66.04,40.29 66.04,43.81 66.84,44.61 66.84,44.92
DATA_BUS_ENABLE_
  Bottom 0.3: IC1.8 44.38,9.25 39.25,14.38 39.25,25.62 33.88,31 33.88,42.75 32.25,44.38 31.5,44.38 IC4.19
DATA_BUS_ENABLE_HV_FROM_TEENSY
  Top 0.3: IC1.4 36.88,16.88 37.25,17.25 38.32,17.25 41.82,20.75 50,20.75 52.25,23 53.75,23 53.88,23.12 B2.HV2
DATA_BUS_ENABLE_LV
  Bottom 0.3: B2.LV2 64.25,23.25 64.62,23.25 66.25,24.88 66.25,31.71 67.56,33.02 U$2.24
FLIPFLOP_CLR  (via drill 0.35)
  Top 0.3: v49.75,30.75 v39.22,30.75
  Bottom 0.3: v39.22,30.75 34.62,35.34 34.62,48.88 32.25,48.88 31.5,49.62 31.5,61.12 30.88,61.75 30.88,62.38 30.5,62.75 IC5.1 30.48,66.36 31.11,66.99 32.38,66.99 33.02,67.63 IC5.13 | v49.75,30.75 51.88,28.62 51.88,21.42 52.55,20.75 53.88,20.75 B2.HV1
FLIPFLOP_CLR_LV
  Bottom 0.3: B2.LV1 65.43,21.93 65.43,23.34 66.88,24.79 66.88,30.05 67.31,30.48 U$2.25
FLIPFLOP_PRE
  Bottom 0.3: IC5.4 38.12,62.88 38.5,63.25 38.5,63.88 40.65,66.03 40.64,66.04 IC5.10 40.64,71.75 41.04,72.16 46.14,72.16 46.99,71.31 46.99,69.53 51.7,69.53 53.54,71.38 55.08,71.38 56.29,70.17 56.38,70.17 56.38,4.88 54.38,2.88 54,2.88 B1.HV1
FLIPFLOP_PRE_LV
  Bottom 0.3: U$2.29 69.12,20.25 66.88,18 66.88,14.29 65.43,13.02 65.43,4.86 64.14,3.57 B1.LV1 64.25,2.88
GND
  pour Top: 0,73.66 0.32,-0.32 103.19,0.32 103.19,73.03
INTERRUPT  (via drill 0.35)
  Top 0.3: IC1.11 44.5,16.75 44.5,14.38 IC1.10 44.62,14.38 45,14.38 53.88,5.5 B1.HV2 | v46.88,55.74 43.99,58.62 39.75,58.62 35.62,62.75 IC5.3
  Bottom 0.3: IC1.11 44.5,16.88 45.12,16.88 47,18.75 47,31.75 49.5,34.25 IC2.11 49.12,34 47.12,36 47.12,55.49 v46.88,55.74 | IC5.11 38.1,67.63 37.47,66.99 36.2,66.99 35.56,66.36 IC5.3
INTERRUPT_LV  (via drill 0.35)
  Top 0.3: v71.12,12.12 64.5,5.5 64.25,5.5 B1.LV2
  Bottom 0.3: U$2.28 70.41,22.86 71.12,22.14 v71.12,12.12
N$1
  Top 0.3: U$2.AREF 82,63.5 84.5,66 U$2.3V3_LO
N$2  (via drill 0.35)
  Top 0.3: U$1.P$10 7.5,22.88 7.5,23.25 10.88,26.62 14.33,26.62 v18.41,22.54
  Bottom 0.3: v18.41,22.54 18.41,43.18 18.02,43.57 18.02,44.18 18.1,44.26 18.1,49.53 19.05,50.48 19.05,52.39 21.27,54.61 IC10.9
N$3
  Bottom 0.3: IC3.1 15.62,20.38 14.34,21.66 14.34,29.82 16.38,31.86 16.38,34.01 17.11,34.74 17.11,35.76 15.88,37 15.88,41.59 16.83,41.59 17.25,42.02 17.25,49.5 18.5,50.75 18.5,52.75 22.88,57.12 23.38,57.12 IC10.10
N$4
  Bottom 0.3: IC3.2 15.62,17.88 16.62,17.88 16.62,18.12 19.88,21.38 19.88,22.41 20,22.54 20,31.09 19.89,31.2 19.89,41.88 20.32,42.31 20.4,42.31 20.64,42.55 20.64,47.62 21.59,48.58 21.59,51.44 22.23,52.07 IC10.8
N$5
  Top 0.3: R1.1 86.88,66.88 84.5,64.5 84.5,63.5 U$2.23/A9
N$6
  Top 0.3: R2.1 86.88,62.12 85.62,60.88 84.5,60.88 U$2.22/A8
N$7
  Top 0.3: IC3.8 23.25,5.12 27.25,9.12 27.25,11.62 31.12,15.5 32.77,15.5 33.02,15.75 37.87,15.75 41.49,19.38 44.38,19.38 IC1.12
N$8
  Bottom 0.3: IC10.6 15.88,54.5 16.62,54.5 17.88,53.25 17.88,50.88 16.62,49.62 16.62,42.34 16.51,42.23 15.25,42.23 15.25,36.91 16.61,35.55 16.61,34.95 15.88,34.22 15.88,32.07 13.84,30.03 13.84,22.02 12.74,20.92 12.74,16.74 13.96,15.52 15.28,15.52 IC3.3
N$9
  Top 0.3: R3.1 90.75,64.38 84.88,58.5 84.5,58.5 U$2.21/A7
N$10
  Bottom 0.3: R1.2 87,69.62 89.25,69.62 RGB_LED1.1
N$12
  Top 0.3: C9.+ 31.5,13.25 31.62,13.25 31.62,11.75 35.62,7.75 46.38,7.75 46.38,4.25 IC9.1 46.38,4 50.5,4 53.12,1.38 54.88,1.38 55.12,1.62 62.88,1.62 63.12,1.38 65,1.38 65.25,1.62 94.12,1.62 94.12,5.12 97.5,8.5 101.25,8.5 101.25,44.88 100.38,45.75 100,45.75 100,48.25 S1.3
N$13  (via drill 0.35)
  Top 0.3: v28.75,63.88 33.25,68.38 52.12,68.38 53.25,69.5 54.25,69.5 B3.HV4
  Bottom 0.3: v28.75,63.88 28.75,51.62 28.88,51.5 28.88,42 31.38,42 IC4.18
N$14
  Top 0.3: R2.2 87,64.88 89.75,67.62 90.75,67.62 RGB_LED1.2
N$15
  Top 0.3: R3.2 93.25,64.5 93.25,67.5 93.5,67.5 RGB_LED1.4
N$16  (via drill 0.35)
  Top 0.3: v80.75,12.62 84.75,8.62 R4.1
  Bottom 0.3: v80.75,12.62 80.75,25.88 82,27.12 82,53.5 84.38,55.88 U$2.20/A6
N$17
  Bottom 0.3: R5.1 84.75,6.38 82.62,8.5 82.62,23.62 83.12,24.12 83.12,25.75 82.62,26.25 82.62,51.62 84.38,53.38 U$2.19/A5/SCL
N$18  (via drill 0.35)
  Top 0.3: v81.25,47.88 84.12,50.75 84.38,50.75 U$2.18/A4/SDA
  Bottom 0.3: R6.1 84.75,3.5 78.25,10 78.25,25.88 79.05,26.67 80.64,26.67 81.25,27.27 v81.25,47.88
N$19
  Top 0.3: R4.2 87.38,8.5 87.88,8 92.25,8 92.38,7.88 RGB_LED2.1
N$20
  Top 0.3: R5.2 87.38,6.38 90.38,6.38 RGB_LED2.2
N$21
  Top 0.3: R6.2 87.38,3.5 87.5,3.62 90.38,3.62 RGB_LED2.4
N$22
  Top 0.508: J1.3 95.25,51.29 S1.2
N$24  (via drill 0.35)
  Top 0.3: v35.38,42.38 34.5,42.38 31.5,39.38 IC4.17 | v39.62,60.75 47.75,60.75 53.88,66.88 54.25,66.88 B3.HV3
  Bottom 0.3: v39.62,60.75 36.88,58 36.88,56.95 36.12,56.2 33.97,56.2 33.97,53.98 36.2,51.75 36.2,47.62 35.38,46.8 v35.38,42.38
N$26
  Top 0.3: IC1.13 44.38,21.88 44.12,21.62 41.62,21.62 37.88,17.88 33.66,17.88 32.29,16.51 29.64,16.51 24.38,11.25 19.25,11.25 17.12,9.12 14.38,9.12 11.5,12 11.5,12.62 U$1.P$1
RD_  (via drill 0.35)
  Top 0.3: v49.88,25.24 49.24,25.88 38.25,25.88 36.88,24.5 IC1.1 36.75,24.38 36.68,24.45 35.24,24.45 33.55,22.75 30.12,22.75 30.02,22.86 29.53,22.86 27.3,25.08 27.3,26.67 26.17,27.81 18.32,27.81 16,30.12 12.12,30.12 11.88,30.38 11.5,30.38 U$1.P$15 | v13.88,45.5 14.41,46.04 23.81,46.04 IC4.1 | v32.25,55.38 31.25,54.38 v26,54.38
  Bottom 0.3: v49.88,25.24 50.5,24.62 50.5,18.36 53.3,15.56 B1.HV4 | v13.88,45.5 14.12,45.25 14.12,33 11.5,30.38 U$1.P$15 | v26,54.38 26,50.62 23.5,50.62 23.12,50.25 23.14,50.23 23.14,49.57 23.81,48.9 IC4.1 | 32.25,55.43 v32.25,55.38 32.25,61.09 31.75,61.59 31.75,63.82 31.11,64.45 31.11,66.04 31.56,66.49 32.59,66.49 33.66,67.55 33.66,68.9 35.24,70.48 IC5.12
RD_LV_  (via drill 0.35)
  Top 0.3: v67.62,25.75 65.88,24 v65.88,18.88
  Bottom 0.3: v67.62,25.75 67.62,26.38 69.12,27.88 U$2.26 | v65.88,18.88 64.25,17.25 64.25,15.62 B1.LV4
RDX_OR_WRX_AND_DATA_BUS_ENABLE_FROM_TEENSY  (via drill 0.35)
  Top 0.3: v33.75,14.75 35.38,13.12 43,13.12 44.38,11.75 IC1.9
  Bottom 0.3: v33.75,14.75 33.5,15 33.5,19.25 28.12,24.62 28.12,61.38 27.25,62.25 23.5,62.25 IC10.12
RDX_OR_WRX_AND_DATA_BUS_ENABLE_FROM_TEENSY_  (via drill 0.35)
  Top 0.3: v27.38,61 23.62,64.75 23.5,64.75 IC10.13
  Bottom 0.3: v27.38,61 27.38,24.62 29.96,22.04 30,22.04 33,19.04 33,14.79 33,14 33.88,14 35.75,12.12 35.75,11.75 36.75,11.75 IC1.6
READ_OR_WRITE
  Bottom 0.3: IC1.5 36.75,14.38 34.38,16.75 34.38,17.5 36.12,19.25 36.75,19.25 IC1.3
VCC
  pour Bottom: 0,73.66 103.5,73.66 103.82,0 0,0
VCC/2  (via drill 0.35)
  Top 0.3: B2.LV 64.25,25.75 65.12,25.75 65.88,26.5 69.88,26.5 70.25,26.88 72.88,26.88 74.25,25.5 U$2.3V3_2 74.38,25.5 74.75,25.5 76.25,27 83.25,27 83.75,26.5 85.12,26.5 86.5,27.88 89.75,27.88 91.12,29.25 v91.12,31.16 | v60.96,15.56 v60.96,11.11
  Bottom 0.3: 91.25,31.16 91.25,35.88 89.75,37.38 89.25,37.38 B6.LV | 91.25,31.16 91.25,21.12 89.25,19.12 B5.LV | 62.12,25.39 62.35,25.62 64.12,25.62 B2.LV | B1.LV 64.12,8 61.01,11.11 v60.96,11.11 | 62.12,25.39 62.12,41.5 62.38,41.75 62.38,43.81 | 64.38,43.75 B4.LV 62.38,43.81 | v91.12,31.16 91.25,31.16 | 62.12,25.39 62.12,16.72 v60.96,15.56 | B3.LV 62.87,61.91 62.38,61.42 62.38,43.81
WAIT_  (via drill 0.35)
  Top 0.3: v38.76,54.51 36.75,52.5 26.62,52.5 24.75,50.62 14.62,50.62 12,53.25 11.5,53.25 U$1.P$33
  Bottom 0.3: v38.76,54.51 39.38,55.12 39.38,58.5 41.67,58.5 43.18,60.01 43.12,60.06 43.12,62.88 IC5.6
WR_  (via drill 0.35)
  Top 0.3: 36.75,22 IC1.2 36.88,22 | U$1.P$13 11.5,27.88 11.62,27.75 15.61,27.75 21.23,22.12 23.08,22.12 v23.18,22.23 | v48.7,22.64 48.35,23 38.88,23 37.88,22 36.88,22 | 36.88,22 36.15,21.27 28.89,21.27 v26.99,23.18
  Bottom 0.3: v48.7,22.64 49.02,22.33 49.02,17.98 53.88,13.12 B1.HV3 | v23.18,22.23 23.5,22.54 26.67,22.54 26.99,22.86 v26.99,23.18
WR_HV
  Bottom 0.3: IC5.9 43.25,70.38 44.88,68.75 51.62,68.75 53.75,70.88 54.88,70.88 55.62,70.12 55.62,38.1 54.35,36.83 53.66,36.83 53.66,33.66 B2.HV4
WR_LV
  Bottom 0.3: U$2.10/CS 69.12,43.12 67.61,41.61 67.63,35.88 65.09,33.34 B2.LV4 64.25,33.38
WR_LV_
  Bottom 0.3: B1.LV3 64.25,13.12 64.62,13.12 66.25,14.75 66.25,18.12 67.49,19.37 67.53,19.37 67.94,19.78 67.94,23.81 69.22,25.08 U$2.27

### Text on the board
tNames: TRS-80 / SS Drive / V2.0